# Altium schematic sheet Sensors_Actuator_lib.SchDoc
size A
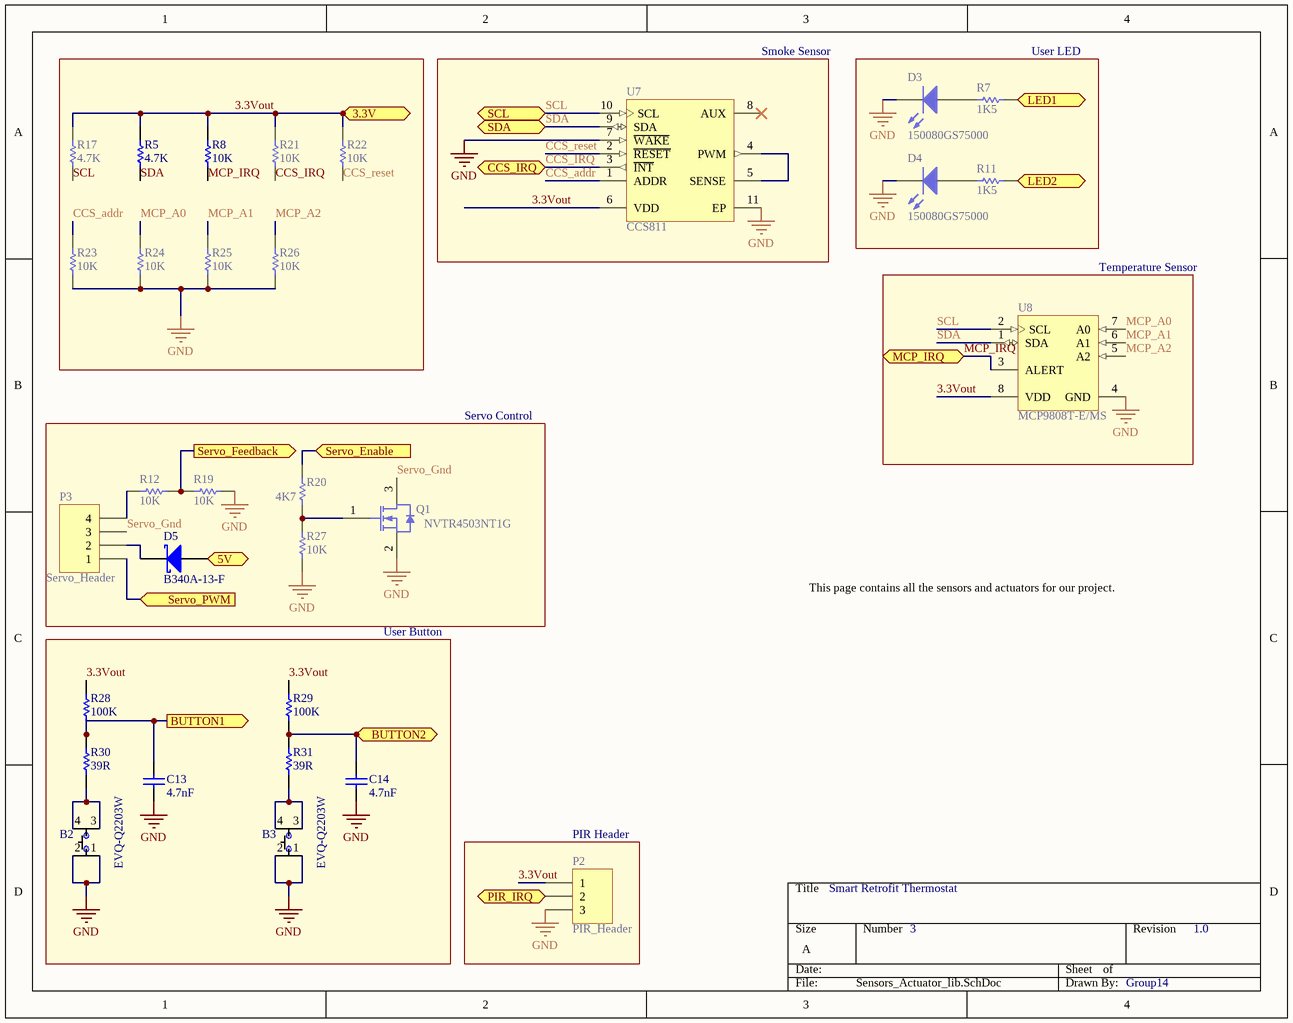
[diagram p0: Sensors_Actuator_lib.SchDoc]

## Parts
B2  EVQ-Q2203W  [EVQ-Q2203W]
B3  EVQ-Q2203W  [EVQ-Q2203W]
C13  4.7nF  [CAPC0805(2012)100_L]
C14  4.7nF  [CAPC0805(2012)100_L]
D3  150080GS75000  [0805_A]
D4  150080GS75000  [0805_A]
D5  B340A-13-F  [DIOD-SMA-2_V]
P2  PIR_Header  [HDR1X3]
P3  Servo_Header  [HDR1X4]
Q1  NVTR4503NT1G  [ONSC-SOT-23-3-318-08_V]
R5  4.7K  [RESC2113X50X35ML15T15]
R7  1K5  [RESC0805(2012)_M]
R8  10K  [RESC0805(2012)_M]
R11  1K5  [RESC0805(2012)_M]
R12  10K  [RESC0805(2012)_M]
R17  4.7K  [RESC2113X50X35ML15T15]
R19  10K  [RESC0805(2012)_M]
R20  4K7  [RESC0805(2012)_M]
R21  10K  [RESC0805(2012)_M]
R22  10K  [RESC0805(2012)_M]
R23  10K  [RESC0805(2012)_M]
R24  10K  [RESC0805(2012)_M]
R25  10K  [RESC0805(2012)_M]
R26  10K  [RESC0805(2012)_M]
R27  10K  [RESC0805(2012)_M]
R28  100K  [RESC0805(2012)_L]
R29  100K  [RESC0805(2012)_L]
R30  39R  [RESC0805(2012)_N]
R31  39R  [RESC0805(2012)_N]
U7  CCS811  [AMS-LGA-10_V]
U8  MCP9808T-E/MS  [MCHP-MSOP-MS8_M]

## Blocks framed on the sheet
Smoke Sensor: U7
User LED: D3 D4 R7 R11
Temperature Sensor: U8
Servo Control: D5 P3 Q1 R12 R19 R20 R27
User Button: B2 B3 C13 C14 R28-R31
PIR Header: P2

## Ports
3.3V, 5V, BUTTON1 (out), BUTTON2 (out), CCS_IRQ, LED1 (in), LED2 (in), MCP_IRQ, PIR_IRQ, SCL (bidir), SDA (bidir), Servo_Enable (in), Servo_Feedback (out), Servo_PWM (in)

## Nets
GND: B2.1 B2.2 B3.1 B3.2 C13.1 C14.1 D3.1(K) D4.1(K) P2.3 Q1.2(S) R19.1 R23.1 R24.1 R25.1 R26.1 R27.1 U7.7(~{WAKE}) U7.11(EP) U8.4(GND)
3.3Vout: P2.1 R5.2 R8.2 R17.2 R21.2 R22.2 R28.1 R29.1 U7.6(VDD) U8.8(VDD) ; port 3.3V
5V: D5.1(A) ; port 5V
BUTTON1: C13.2 R28.2 R30.1 ; port BUTTON1
BUTTON2: C14.2 R29.2 R31.1 ; port BUTTON2
CCS_addr: R23.2 U7.1(ADDR)
CCS_IRQ: R21.1 U7.3(~{INT}) ; port CCS_IRQ
CCS_reset: R22.1 U7.2(~{RESET})
LED1: R7.2 ; port LED1
LED2: R11.2 ; port LED2
MCP_A0: R24.2 U8.7(A0)
MCP_A1: R25.2 U8.6(A1)
MCP_A2: R26.2 U8.5(A2)
MCP_IRQ: R8.1 U8.3(ALERT) ; port MCP_IRQ
PIR_IRQ: P2.2 ; port PIR_IRQ
SCL: R17.1 U7.10(SCL) U8.2(SCL) ; port SCL
SDA: R5.1 U7.9(SDA) U8.1(SDA) ; port SDA
Servo_Enable: R20.2 ; port Servo_Enable
Servo_Feedback: R12.1 R19.2 ; port Servo_Feedback
Servo_Gnd: P3.3 Q1.3(D)
Servo_PWM: P3.1 ; port Servo_PWM
NetB2_3: B2.3 B2.4 R30.2
NetB3_3: B3.3 B3.4 R31.2
NetD3_2: D3.2(A) R7.1
NetD4_2: D4.2(A) R11.1
NetD5_2: D5.2(K) P3.2
NetP3_4: P3.4 R12.2
NetQ1_1: Q1.1(G) R20.1 R27.2
NetU7_4: U7.4(PWM) U7.5(SENSE)

Not connected (* = marked no-connect by the designer): U7 8(AUX)*

## Notes on the sheet
- This page contains all the sensors and actuators for our project.
- Smart Retrofit Thermostat
- 3
- 1.0
- Group14

## Library data of the parts
B2 B3 = EVQ-Q2203W: SWITCH TACTILE SPST-NO 0.02A 15V; Manufacturer: Panasonic Electronic Components; Switch Function: Off-Mom; Contact Rating @ Voltage: 0.02A @ 15VDC; Actuator Type: Standard; Actuator Height off PCB, Vertical: 3.10mm; Actuator Orientation: Top Actuated; Outline: 6.60mm x 6.00mm; Illumination: Non-Illuminated; Operating Force: 350gf; Switch Travel: 0.25mm; Mechanical Life: 100,000 Cycles; Supplier 1: Digi-Key; Manufacturer Part Number: EVQ-Q2203W; RoHS: RoHS Compliant; Category: Switches; Stock 1: 15024; Pricing 1: 1=0.3, 10=0.287, 25=0.2772, 50=0.2674, 100=0.2525, 250=0.2376, 500=0.2277, 1000=0.17325 (USD); Packaging: Cut Tape (CT); Part Status: Active; Circuit: SPST-NO; Mounting Type: Surface Mount; Actuator Length, Right Angle: -; Termination Style: J Lead; Illumination Type, Color: -; Illumination Voltage (Nominal): -; Ingress Protection: -; Features: Grounding Pin; Actuator Material: -; Operating Temperature: -40°C ~ 85°C; ComponentLink1URL: https://industrial.panasonic.com/cdbs/www-data/pdf/ATK0000/ATK0000CE28.pdf; ComponentLink1Description: https://industrial.panasonic.com/cdbs/www-data/pdf/ATK0000/ATK0000CE28.pdf; Supplier Part Number 1: P12964SCT-ND
C13 C14 = CMP-1036-03568-1: CAP 4.7nF 16V ±20% 0805 (2012 Metric) Thickness 1mm SMD; Case-EIA: 0805; Tolerance: Â±20%; Case-Metric: 2012; Value: 4.7nF; Rated Voltage: 16 V; Max Thickness: 1 mm; Technology: SMT
D3 D4 = CMP-1426-00007-1: SMD mono-color Chip LED, WL-SMCW, Green; Manufacturer: Wuerth Elektronik; PackageReference: 0805_A; Color: Green; PartNumber: 150080GS75000; ComponentLink2URL: http://katalog.we-online.com/led/datasheet/150080GS75000.pdf; ComponentLink1URL: http://www.we-online.com; ComponentLink1Description: Manufacturer URL; ComponentLink2Description: Datasheet
D5 = CMP-1667-00003-1: Surface Mount Schottky Barrier Rectifier, 40 V, 3 A, -55 to 150 degC, 2-Pin SMA, RoHS, Tape and Reel; Forward Current: 3 A; Forward Voltage: 500 mV; Max Surge Current: 80 A; Peak Reverse Current: 500 uA; Elements: 1; Mounting Technology: Surface Mount; ComponentLink1URL: http://www.diodes.com/; PackageDescription: 2-Pin Surface Mounted Assembly, Body 4.3 x 2.605 mm, Height 2.4 mm; Min Operating Temperature: -55 degC; Mount: Surface Mount; Pins: 2; ComponentLink2URL: http://www.diodes.com/_files/datasheets/ds30891.pdf; PackageReference: SMA-2; Max Operating Temperature: 125 degC; Radiation Hardening: No; Length: 4.6 mm; RoHSCompliant: true; ComponentLink1Description: Manufacturer URL; Height: 2.1 mm; ComponentLink2Description: Datasheet; Packaging: Tape and Reel; Package Quantity: 5000; Case\Package: SMA; DatasheetVersion: Rev. 17 - 2, 09/2015; REACH SVHC: No SVHC; Width: 2.92 mm
P2 = Header 3: Header, 3-Pin; LatestRevisionDate: 17-Jul-2002; LatestRevisionNote: Re-released for DXP Platform.; Publisher: Altium Limited
P3 = Header 4: Header, 4-Pin; LatestRevisionDate: 17-Jul-2002; LatestRevisionNote: Re-released for DXP Platform.; Publisher: Altium Limited
Q1 = CMP-1058-00743-1: Power MOSFET, 30 V, 2.5 A, Single N-Channel, 3-Pin SOT-23, Pb-Free, Tape and Reel; Manufacturer: On Semiconductor; VGS(th) Max (V): 3; VGS Max (V): 20; Channel Polarity: N Channel; ID Max (A): 2.5; Qrr Typ (nC): 4; V(BR)DSS Min (V): 30; PackageReference: SOT-23-3-318-08; RoHS: Pb-Free; ComponentLink3Description: Package Specification; PackageVersion: Rev. AP, 11/2009; PartNumber: NVTR4503NT1G; ComponentLink1URL: http://www.onsemi.com/; ComponentLink2URL: http://www.onsemi.cn/pub_link/Collateral/NTR4503N-D.PDF; ComponentLink1Description: Manufacturer URL; Packing: Tape and Reel; ComponentLink2Description: Datasheet; Package Type: SOT-23-3; Configuration: Single; Mounting Technology: Surface Mount; ComponentLink3URL: http://www.onsemi.cn/pub_link/Collateral/318-08.PDF; PackageDescription: 3-Pin Small Outline Transistor, Body 2.92 x 1.3 mm, Pitch 0.95 mm; DatasheetVersion: Rev. 6
R5 R17 = CMP-2100-03615-1: Chip Resistor, 4.7 KOhm, +/- 1%, 0.125 W, -55 to 155 degC, 0805 (2012 Metric), RoHS, Tape and Reel; Manufacturer: Vishay Semiconductor; Temperature Coefficient: 100ppm/degreesC; Voltage Rating: 150V; Max Power Dissipation: 125mW; Tolerance: 1%; Packaging: TapeandReel; Max Operating Temperature: 155degC; Case Code (Imperial): 0805; Case/Package: 0805; Radiation Hardening: No; Package Reference: 0805; Lead Free: LeadFree; Package Description: 2-Pin Surface Mount Device, Body 2.05 x 1.25 mm; Manufacturer URL: http://www.vishay.com/; Height: 0.45mm; REACH SVHC: Unknown; Termination: SMD/SMT; Length: 2mm; Depth: 1.25mm; Case Code (Metric): 2012; Package Quantity: 10; Weight: 0.000194oz; Military Standard: Not; RoHSCompliant: true; Composition: ThickFilm; Contact Plating: Tin; Datasheet Version: 41061.0; Datasheet URL: https://datasheet.ciiva.com/11808/0900766b80d98b26-11808992.pdf; Width: 1.25mm; Number of Terminations: 2; Min Operating Temperature: -55degC; Power Rating: 125mW; Resistance: 4.7KOhm; Voltage Rating (DC): 150V
R7 R11 = CMP-1013-00528-1: 1K5 0.125W 1% 0805 (2012 Metric)  SMD; Value: 1500.00 Ohm; Case-Metric: 2012; Case-EIA: 0805; Technology: SMT; Power: 0.125 W; Tolerance: 1 %
R8 R12 R19 R21-R27 = CMP-1013-00623-1: 10K 0.125W 1% 0805 (2012 Metric)  SMD; Value: 10000.00 Ohm; Case-Metric: 2012; Case-EIA: 0805; Technology: SMT; Power: 0.125 W; Tolerance: 1 %
R20 = CMP-1013-00586-1: 4K7 0.125W 1% 0805 (2012 Metric)  SMD; Case-Metric: 2012; Case-EIA: 0805; Value: 4700.00 Ohm; Technology: SMT; Power: 0.125 W; Tolerance: 1 %
R28 R29 = CMP-1013-00736-1: 100K 0.125W 1% 0805 (2012 Metric)  SMD; Value: 100000.00 Ohm; Case-Metric: 2012; Case-EIA: 0805; Technology: SMT; Power: 0.125 W; Tolerance: 1 %
R30 R31 = CMP-1013-00350-1: 39R 0.125W 1% 0805 (2012 Metric)  SMD; Value: 39.00 Ohm; Case-Metric: 2012; Case-EIA: 0805; Technology: SMT; Power: 0.125 W; Tolerance: 1 %
U7 = CMP-2000-07443-1: Ultra-Low Power Digital Gas Sensor for Monitoring Indoor Air Quality, 26 mA, 1.8 to 3.3 V, -5 to 50 degC, 10-Pin LGA, RoHS; Manufacturer: AMS; Package Description: 10-Pin Small Outline Non-lead, Body 4 x 2.7 mm, Pitch 0.6 mm; Datasheet URL: http://ams.com/eng/content/download/951091/2269479/471718; Manufacturer URL: http://www.ams.org/home/page; Datasheet Version: Rev. 1-02, 03/2017; Package Reference: LGA-10; RoHSCompliant: false; Mounting Technology: SurfaceMount
U8 = CMP-0192-00343-1: + / - 0.5 degC Maximum Accuracy Digital Temperature Sensor, 400 uA, 2.7 to 5.5 V, -40 to 125 degC, 8-pin MSOP (MS8), Tape and Reel; Manufacturer: Microchip; PackageVersion: C04-111C; ComponentLink1URL: http://www.microchip.com; ComponentLink2URL: http://ww1.microchip.com/downloads/en/DeviceDoc/25095A.pdf; PackageReference: MSOP-MS8; ComponentLink2Description: Datasheet; DatasheetVersion: Rev. A; ComponentLink1Description: Manufacturer URL; PackageDescription: 8-Lead Plastic Micro Small Outline Package, 3 x 3 mm Body, 0.65 mm Pitch; ComponentLink3Description: Package Specification; ComponentLink3URL: http://www.microchip.com/stellent/groups/techpub_sg/documents/packagingspec/en012702.pdf; PartNumber: MCP9808T-E/MS; ComponentLink4URL: http://www.microchip.com/MCP9808; ComponentLink4Description: Product URL; Mounting Technology: Surface Mount